# Altium schematic sheet topologia_puente_con_rshunt.SchDoc
size A4
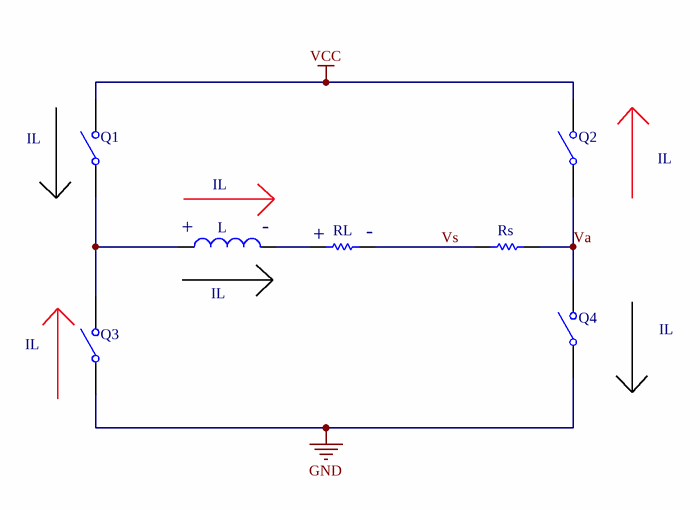
[diagram p0: topologia_puente_con_rshunt.SchDoc]

## Parts
L  Inductor  [0402-A]  (value not drawn)
Q1  SW-SPST  [SPST-2]  (value not drawn)
Q2  SW-SPST  [SPST-2]  (value not drawn)
Q3  SW-SPST  [SPST-2]  (value not drawn)
Q4  SW-SPST  [SPST-2]  (value not drawn)
RL  Res1  [AXIAL-0.3]  (value not drawn)
Rs  Res1  [AXIAL-0.3]  (value not drawn)

## Nets
GND: Q3.1(COMMON) Q4.1(COMMON)
VCC: Q1.2(NO) Q2.2(NO)
Va: Q2.1(COMMON) Q4.2(NO) Rs.2
Vs: RL.2 Rs.1
NetL_1: L.1 Q1.1(COMMON) Q3.2(NO)
NetL_2: L.2 RL.1

## Notes on the sheet
- (near Q1) IL
- IL
- (near L) +
- (near L) IL
- (near L) -
- (near RL) +
- (near RL) -
- (near Q3) IL

## Library data of the parts
L = Inductor: Code_IEC: 1005; Value: 10mH; Published: 8-Jun-2000; LatestRevisionDate: 29-May-2009; LatestRevisionNote: IPC-7351 Footprint Added.; PackageReference: 0402-A; Publisher: Altium Limited; PackageDescription: Chip Inductor; Code_JEITA: 0402
Q1-Q4 = SW-SPST: Single-Pole, Single-Throw Switch; Published: 24-Mar-1999; LatestRevisionDate: 17-Jul-2002; LatestRevisionNote: Re-released for DXP Platform.; PackageReference: SPST-2; Publisher: Altium Limited; PackageDescription: Switch; 2 Leads
RL Rs = Res1: Resistor; Value: 1K; Published: 8-Jun-2000; LatestRevisionDate: 17-Jul-2002; LatestRevisionNote: Re-released for DXP Platform.; PackageReference: AXIAL-0.3; Publisher: Altium Limited; PackageDescription: Axial Device, Thru-Hole; 2 Leads; 0.3 in Pin Spacing